# Altium schematic sheet RTC.SchDoc
size Letter; Organization: Midnight Sun Solar Rayce Car Team; Address1: University of Waterloo; Address2: 200 University Ave W; Address3: Waterloo, ON, Canada; Address4: N2L 3E9; Website: www.uwmidsun.com
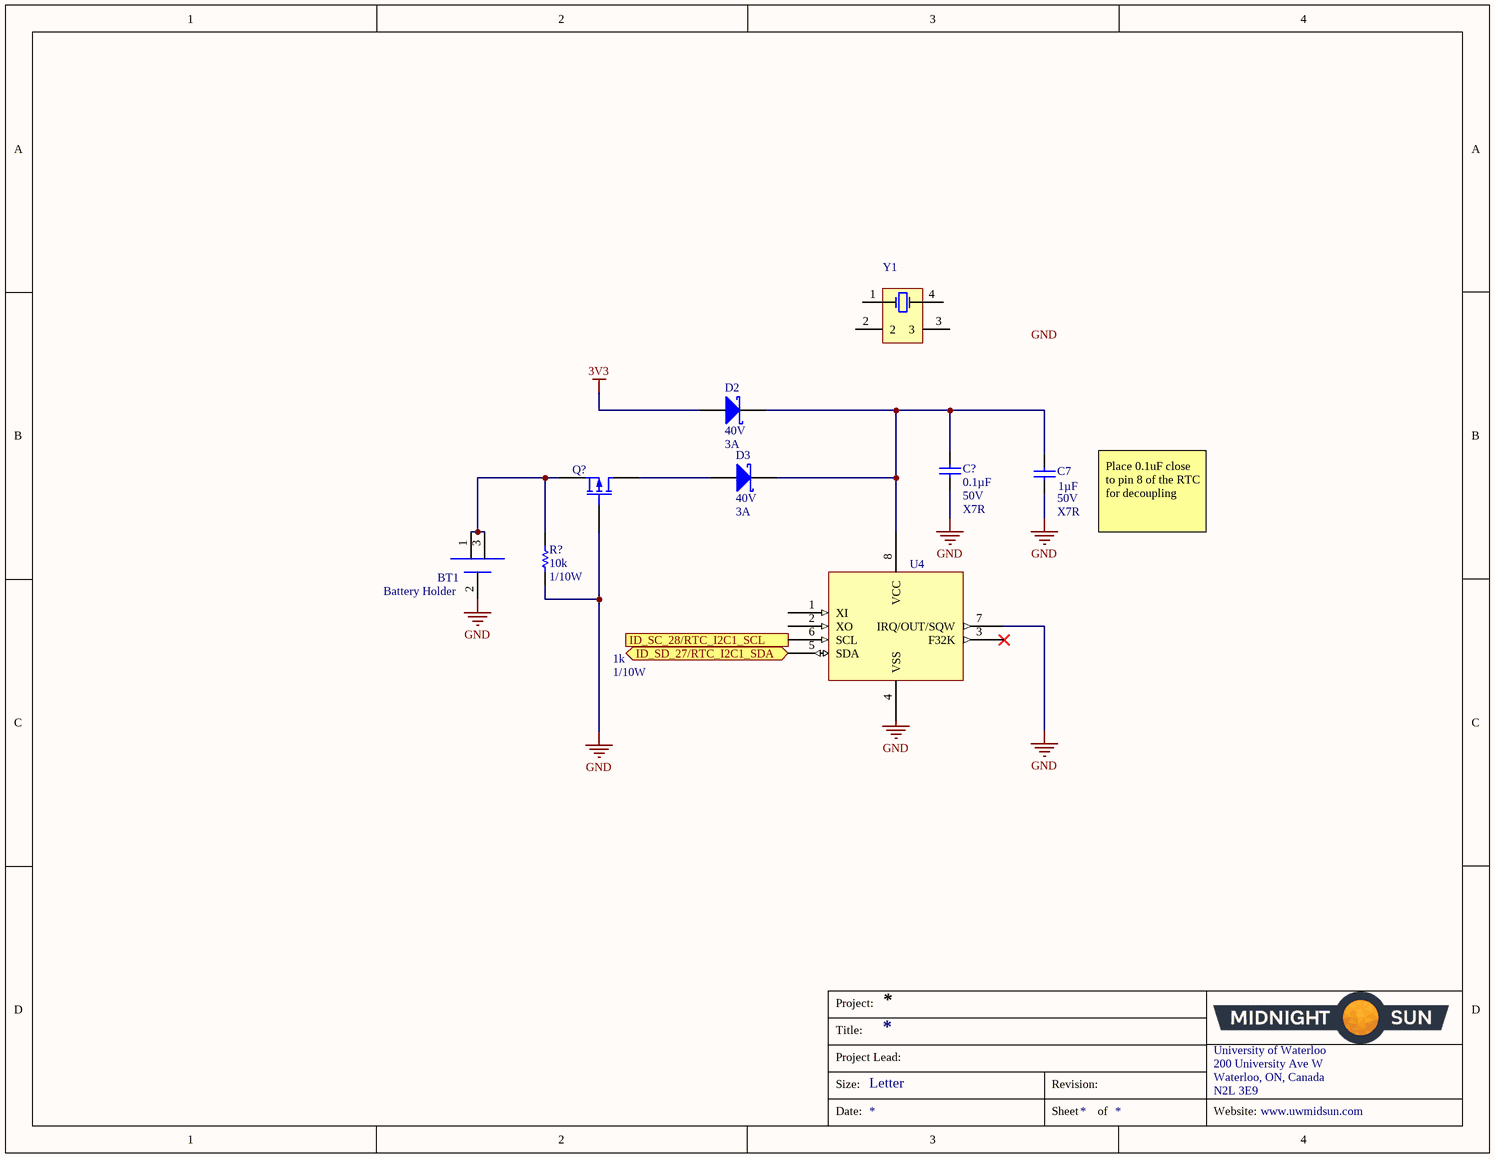
[diagram p0: RTC.SchDoc]

## Parts
BT1  HOLDER COIN CELL FOR CR1220 SMD  [HOLDER BUTTON BATTERY 3V]  (value not drawn)
C7  Capacitance: 1µF  Voltage: 50V  Temperature Coefficient: X7R  [CAP, 0603]  (hidden comment: CAP CER 1UF 50V 10% X7R 0603)
C?  Capacitance: 0.1µF  Voltage: 50V  Temperature Coefficient: X7R  [CAP, 0603]  (hidden comment: CAP CER 0.1UF 50V 10% X7R 0603)
D2  Voltage - DC Reverse (Vr) (Max): 40V  Current - Average Rectified (Io): 3A  [DO-214AA Diode]  (hidden comment: DIODE SCHOTTKY 40V 3A DO-214AA (SMB))
D3  Voltage - DC Reverse (Vr) (Max): 40V  Current - Average Rectified (Io): 3A  [DO-214AA Diode]  (hidden comment: DIODE SCHOTTKY 40V 3A DO-214AA (SMB))
Q?  MOSFET P-CH 16V 2.5A X2-DFN2015  [DFN86P197X40-3N]  (value not drawn)
R?  Resistance: 10k  Power: 1/10W  [RES, 0603]  (hidden comment: RES 10K OHM 1% 1/10W 0603)
U4  IC RTC CLK/CALENDAR I2C 8-SOIC  [SOIC8]  (value not drawn)
Y1  CRYSTAL 32.7680KHZ 12.5PF SMD  [4-SOJ]  (value not drawn)

## Ports
ID_SC_28/RTC_I2C1_SCL (in), ID_SD_27/RTC_I2C1_SDA (bidir)

## Nets
3V3: D2.1(A)
GND: BT1.2(negative) C7.2 C?.2 Q?.1(G) R?.2 U4.7(IRQ/OUT/SQW)
ID_SC_28/RTC_I2C1_SCL: U4.6(SCL) ; port ID_SC_28/RTC_I2C1_SCL
ID_SD_27/RTC_I2C1_SDA: U4.5(SDA) ; port ID_SD_27/RTC_I2C1_SDA
NetBT1_1: BT1.1(positive_1) BT1.3(positive_2) Q?.2(S) R?.1
NetC7_1: C7.1 C?.1 D2.2(K) D3.2(K) U4.8(VCC)
NetD3_1: D3.1(A) Q?.3(D)

Not connected (* = marked no-connect by the designer): U4 1(XI) 2(XO) 3(F32K)* 4(VSS); Y1 1 2 3 4

## Notes on the sheet
- Place 0.1uF close to pin 8 of the RTC for decoupling
- (near BT1) Battery Holder
- 1k
- 1/10W
- Project:
- Title:
- Size:
- Project Lead:
- Letter
- Revision:
- University of Waterloo
- 200 University Ave W
- Waterloo, ON, Canada
- N2L 3E9
- Date:
- Sheet
- of
- Website:
- Labels drawn without touching a wire or pin: GND

## Library data of the parts
BT1 = HOLDER COIN CELL FOR CR1220 SMD: Coin cell holder; Manufacturer: Memory Protection Devices; Manufacturer Part Number: BC501SM-TR; Number of Cells: 1; Body Material: Bronze; Supplier 1: Digi-Key; Stock 1: 21261; Pricing 1: 1=1.26, 10=1.166, 100=1.1029 (USD); Mount: Surface Mount,PCB; Case/Package: SMD/SMT; Min Operating Temperature: -40°C; Max Operating Temperature: 85°C; Package Quantity: 500; Termination: SMD/SMT; ComponentLink1URL: https://datasheet.ciiva.com/4/bc501sm-tr-datasheet-4384.pdf; ComponentLink1Description: https://datasheet.ciiva.com/4/bc501sm-tr-datasheet-4384.pdf; Supplier 2: Digi-Key; Stock 2: 19094; Pricing 2: 1=0.58, 10=0.545, 50=0.4356, 100=0.4175, 250=0.3812, 500=0.363, 1000=0.305, 2500=0.2723, 5000=0.2632 (USD); Contact Material: Bronze,Nickel; Material: Bronze; Contact Plating: Nickel; Packaging: Bulk; Number of Batteries: 1; Diameter: 12mm; Height: 3.17mm; REACH SVHC: No SVHC; Lead Free: Lead Free; ComponentLink2URL: https://datasheet.ciiva.com/3/3000-3953.pdf; ComponentLink2Description: https://datasheet.ciiva.com/3/3000-3953.pdf; ComponentLink3URL: https://datasheet.ciiva.com/11714/0900766b8002ef78-11714721.pdf; ComponentLink3Description: https://datasheet.ciiva.com/11714/0900766b8002ef78-11714721.pdf; ComponentLink4URL: https://datasheet.ciiva.com/20221/18-3570e-20221596.pdf; ComponentLink4Description: https://datasheet.ciiva.com/20221/18-3570e-20221596.pdf; ComponentLink5URL: https://datasheet.ciiva.com/1391/1718262-1391630.pdf; ComponentLink5Description: https://datasheet.ciiva.com/1391/1718262-1391630.pdf; Supplier Part Number 2: 36-3000-ND
C7 = CAP CER 1UF 50V 10% X7R 0603: 1µF ±10% 50V Ceramic Capacitor X7R 0603 (1608 Metric); Manufacturer 1: Taiyo Yuden; Manufacturer Part Number 1: UMK107AB7105KA-T; Supplier 1: Digi-Key; Supplier Part Number 1: 587-3247-1-ND; Packaging: Cut Tape (CT); Part Status: Active; Operating Temperature: -55°C ~ 125°C; Ratings: -; Mounting Type: Surface Mount, MLCC; Package / Case: 0603 (1608 Metric); Size / Dimension: 0.063" L x 0.031" W (1.60mm x 0.80mm); Height - Seated (Max): -; Thickness (Max): 0.037" (0.95mm); Lead Spacing: -; Lead Style: -; ComponentLink1URL: http://www.yuden.co.jp/productdata/catalog/en/mlcc_all_e.pdf; ComponentLink1Description: http://www.yuden.co.jp/productdata/catalog/en/mlcc_all_e.pdf; Tolerance: ±10%
C? = CAP CER 0.1UF 50V 10% X7R 0603: 0.10µF ±10% 50V Ceramic Capacitor X7R 0603 (1608 Metric); Manufacturer 1: AVX Corporation; Manufacturer Part Number 1: 06035C104KAT2A; Supplier 1: Digi-Key; Supplier Part Number 1: 478-5052-1-ND; Packaging: Cut Tape (CT); Part Status: Active; Operating Temperature: -55°C ~ 125°C; Ratings: -; Mounting Type: Surface Mount, MLCC; Package / Case: 0603 (1608 Metric); Size / Dimension: 0.063" L x 0.032" W (1.60mm x 0.81mm); Height - Seated (Max): -; Thickness (Max): 0.035" (0.90mm); Lead Spacing: -; Lead Style: -; ComponentLink1URL: http://datasheets.avx.com/X7RDielectric.pdf; ComponentLink1Description: http://datasheets.avx.com/X7RDielectric.pdf; Tolerance: ±10%
D2 D3 = DIODE SCHOTTKY 40V 3A DO-214AA (SMB): Diode Schottky 40V 3A Surface Mount DO-214AA (SMB); Manufacturer 1: Comchip Technology; Manufacturer Part Number 1: CDBB340-HF; Voltage - Forward (Vf) (Max) @ If: 500mV @ 3A; Speed: Fast Recovery =< 500ns, > 200mA (Io); Current - Reverse Leakage @ Vr: 500µA @ 40V; Capacitance @ Vr, F: 250pF @ 4V, 1MHz; Supplier 1: Digi-Key; Supplier Part Number 1: 641-1722-1-ND; Packaging: Cut Tape (CT); Part Status: Active; Diode Type: Schottky; Mounting Type: Surface Mount; Package / Case: DO-214AA, SMB; Supplier Device Package: DO-214AA (SMB); Operating Temperature - Junction: -40°C ~ 70°C; ComponentLink1URL: http://www.comchiptech.com/cms/UserFiles/CDBB340-HF%20Thru849517.%20CDBB3100-HF%20RevE.pdf; ComponentLink1Description: http://www.comchiptech.com/cms/UserFiles/CDBB340-HF%20Thru849517.%20CDBB3100-HF%20RevE.pdf
Q? = MOSFET P-CH 16V 2.5A X2-DFN2015: P-Channel 16V 2.5A (Ta) 650mW (Ta) Surface Mount X2-DFN2015-3; Manufacturer 1: Diodes Incorporated; Manufacturer Part Number 1: DMG3415UFY4Q-7; Drive Voltage (Max Rds On,  Min Rds On): 1.8V, 4.5V; Vgs(th) (Max) @ Id: 1V @ 250µA; Gate Charge (Qg) (Max) @ Vgs: 10nC @ 4.5V; Input Capacitance (Ciss) (Max) @ Vds: 282pF @ 10V; Vgs (Max): ±8V; Rds On (Max) @ Id, Vgs: 39 mOhm @ 4A, 4.5V; Supplier 1: Digi-Key; Supplier Part Number 1: DMG3415UFY4Q-7DICT-ND; Packaging: Cut Tape (CT); Part Status: Active; FET Type: P-Channel; Technology: MOSFET (Metal Oxide); Drain to Source Voltage (Vdss): 16V; Current - Continuous Drain (Id) @ 25°C: 2.5A (Ta); FET Feature: -; Power Dissipation (Max): 650mW (Ta); Operating Temperature: -55°C ~ 150°C (TJ); Mounting Type: Surface Mount; Supplier Device Package: X2-DFN2015-3; Package / Case: 3-XFDFN; ComponentLink1URL: https://www.diodes.com/assets/Datasheets/DMG3415UFY4Q.pdf; ComponentLink1Description: https://www.diodes.com/assets/Datasheets/DMG3415UFY4Q.pdf
R? = RES 10K OHM 1% 1/10W 0603: RES SMD 10K OHM 1% 1/10W 0603; Manufacturer 1: Yageo; Manufacturer Part Number 1: RC0603FR-0710KL; Temperature Coefficient: ±100ppm/°C; Supplier 1: Digi-Key; Supplier Part Number 1: 311-10.0KHRCT-ND; Packaging: Cut Tape (CT); Part Status: Active; Composition: Thick Film; Operating Temperature: -55°C ~ 155°C; Package / Case: 0603 (1608 Metric); Supplier Device Package: 0603; Size / Dimension: 0.063" L x 0.031" W (1.60mm x 0.80mm); Height - Seated (Max): 0.022" (0.55mm); Failure Rate: -; ComponentLink1URL: http://www.yageo.com/documents/recent/PYu-RC_Group_51_RoHS_L_7.pdf; ComponentLink1Description: http://www.yageo.com/documents/recent/PYu-RC_Group_51_RoHS_L_7.pdf; Tolerance: ±1%
U4 = IC RTC CLK/CALENDAR I2C 8-SOIC: Real Time Clock (RTC) IC Clock/Calendar I²C, 2-Wire Serial 8-SOIC (0.154", 3.90mm Width); Manufacturer: STMicroelectronics; Manufacturer Part Number: M41T80M6F; Non-volatile Memory Size: 20B; Max Supply Voltage: 5.5V; Min Supply Voltage: 2V; Interface: I2C,Serial,2-Wire; Time Format: HH:MM:SS:hh (24 hr); Date Format: YY-MM-DD-dd; Supplier 1: Digi-Key; Stock 1: 1177; Pricing 1: 1=2.24, 10=2.012, 100=1.6169, 500=1.3284, 1000=1.1007 (USD); Mount: Surface Mount; Case/Package: SOIC; Number of Pins: 8; Weight: 0.019048oz; Contact Plating: Tin,Matte; Min Operating Temperature: -40°C; Max Operating Temperature: 85°C; Packaging: Tape and Reel; Package Quantity: 2500; Logic Function: Clock; Memory Size: 20B; RAM Size: 20B; Radiation Hardening: No; Lead Free: Lead Free; ComponentLink1URL: https://datasheet.ciiva.com/4772/cd00003119-4772151.pdf; ComponentLink1Description: https://datasheet.ciiva.com/4772/cd00003119-4772151.pdf; ComponentLink2URL: https://datasheet.ciiva.com/8145/cd00003119-8145447.pdf; ComponentLink2Description: https://datasheet.ciiva.com/8145/cd00003119-8145447.pdf; ComponentLink3URL: https://datasheet.ciiva.com/26795/m41t80m6f-26795475.pdf; ComponentLink3Description: https://datasheet.ciiva.com/26795/m41t80m6f-26795475.pdf; ComponentLink4URL: https://datasheet.ciiva.com/41459/001185350-da-01-en-ic-rtc-serial-w-ala-m41t80m6f-soic-8-stm-41459822.pdf; ComponentLink4Description: https://datasheet.ciiva.com/41459/001185350-da-01-en-ic-rtc-serial-w-ala-m41t80m6f-soic-8-stm-41459822.pdf; Supplier Part Number 1: 497-4708-1-ND
Y1 = CRYSTAL 32.7680KHZ 12.5PF SMD: 32.768kHz ±20ppm Crystal 12.5pF 50 kOhms 4-SOJ, 5.50mm pitch; Manufacturer: ECS International; Manufacturer Part Number: ECS-.327-12.5-17X-TR; ESR (Equivalent Series Resistance): 50kR; Supplier 1: Digi-Key; Stock 1: 67622; Pricing 1: 1=0.56, 10=0.468, 50=0.4208, 100=0.374, 500=0.3553, 1000=0.2992 (USD); Mount: Surface Mount; Min Operating Temperature: -40°C; Max Operating Temperature: 85°C; Package Quantity: 1; Frequency: 32.768kHz; Frequency Tolerance: 20ppm; Load Capacitance: 12.5pF; Packaging: Tape and Reel; Tolerance: 20ppm; Termination: SMD/SMT; Length: 0.315inch; Height: 0.098inch; Width: 0.15inch; Lead Free: Lead Free; ComponentLink1URL: https://datasheet.ciiva.com/852/ecx-306x-852775.pdf; ComponentLink1Description: https://datasheet.ciiva.com/852/ecx-306x-852775.pdf; ComponentLink2URL: https://datasheet.ciiva.com/852/ecx-306x-852776.pdf; ComponentLink2Description: https://datasheet.ciiva.com/852/ecx-306x-852776.pdf; ComponentLink3URL: https://datasheet.ciiva.com/852/ecx-306x-852777.pdf; ComponentLink3Description: https://datasheet.ciiva.com/852/ecx-306x-852777.pdf; Supplier Part Number 1: XC1195CT-ND